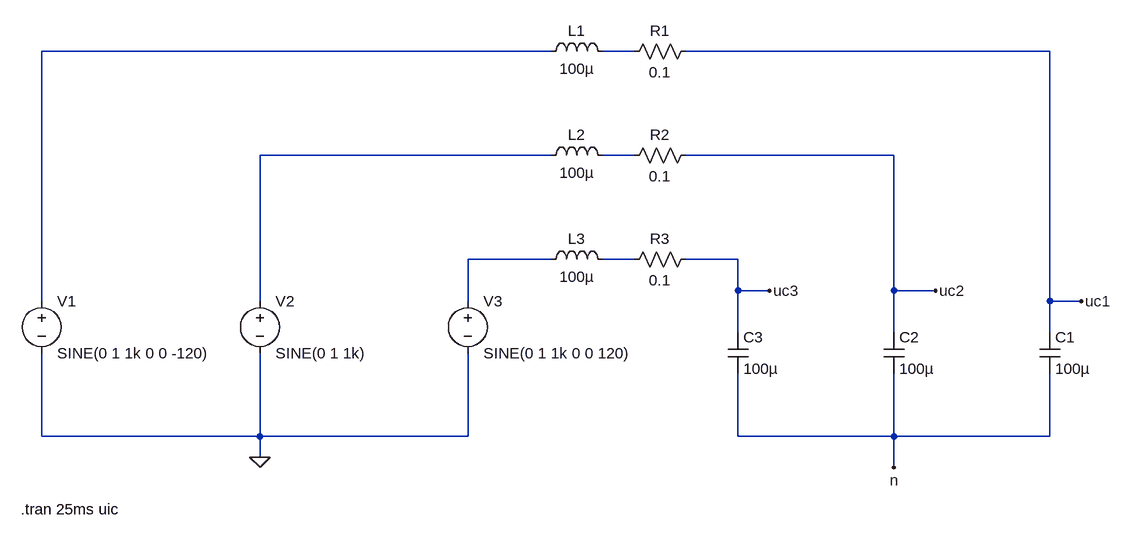
[diagram p0: schematic 3ph_lc.asc]
3ph_lc.asc, the LTspice schematic file:
Version 4
SHEET 1 1684 680
WIRE 736 -224 -48 -224
WIRE 864 -224 816 -224
WIRE 1504 -224 944 -224
WIRE 736 -64 288 -64
WIRE 864 -64 816 -64
WIRE 1264 -64 944 -64
WIRE 736 96 608 96
WIRE 864 96 816 96
WIRE 1024 96 944 96
WIRE 1024 144 1024 96
WIRE 1072 144 1024 144
WIRE 1264 144 1264 -64
WIRE 1328 144 1264 144
WIRE -48 160 -48 -224
WIRE 288 160 288 -64
WIRE 608 160 608 96
WIRE 1504 160 1504 -224
WIRE 1552 160 1504 160
WIRE 1024 208 1024 144
WIRE 1264 208 1264 144
WIRE 1504 208 1504 160
WIRE -48 368 -48 240
WIRE 288 368 288 240
WIRE 288 368 -48 368
WIRE 608 368 608 240
WIRE 608 368 288 368
WIRE 1024 368 1024 272
WIRE 1264 368 1264 272
WIRE 1264 368 1024 368
WIRE 1504 368 1504 272
WIRE 1504 368 1264 368
WIRE 288 400 288 368
WIRE 1264 416 1264 368
FLAG 288 400 0
FLAG 1264 416 n
FLAG 1552 160 uc1
FLAG 1328 144 uc2
FLAG 1072 144 uc3
SYMBOL voltage -48 144 R0
WINDOW 123 0 0 Left 0
WINDOW 39 0 0 Left 0
SYMATTR InstName V1
SYMATTR Value SINE(0 1 1k 0 0 -120)
SYMBOL voltage 288 144 R0
WINDOW 123 0 0 Left 0
WINDOW 39 0 0 Left 0
SYMATTR InstName V2
SYMATTR Value SINE(0 1 1k)
SYMBOL voltage 608 144 R0
WINDOW 123 0 0 Left 0
WINDOW 39 0 0 Left 0
SYMATTR InstName V3
SYMATTR Value SINE(0 1 1k 0 0 120)
SYMBOL ind 720 112 R270
WINDOW 0 32 56 VTop 2
WINDOW 3 5 56 VBottom 2
SYMATTR InstName L3
SYMATTR Value 100µ
SYMBOL ind 720 -48 R270
WINDOW 0 32 56 VTop 2
WINDOW 3 5 56 VBottom 2
SYMATTR InstName L2
SYMATTR Value 100µ
SYMBOL ind 720 -208 R270
WINDOW 0 32 56 VTop 2
WINDOW 3 5 56 VBottom 2
SYMATTR InstName L1
SYMATTR Value 100µ
SYMBOL cap 1008 208 R0
SYMATTR InstName C3
SYMATTR Value 100µ
SYMBOL cap 1248 208 R0
SYMATTR InstName C2
SYMATTR Value 100µ
SYMBOL cap 1488 208 R0
SYMATTR InstName C1
SYMATTR Value 100µ
SYMBOL res 960 -240 R90
WINDOW 0 0 56 VBottom 2
WINDOW 3 32 56 VTop 2
SYMATTR InstName R1
SYMATTR Value 0.1
SYMBOL res 960 -80 R90
WINDOW 0 0 56 VBottom 2
WINDOW 3 32 56 VTop 2
SYMATTR InstName R2
SYMATTR Value 0.1
SYMBOL res 960 80 R90
WINDOW 0 0 56 VBottom 2
WINDOW 3 32 56 VTop 2
SYMATTR InstName R3
SYMATTR Value 0.1
TEXT -80 480 Left 2 !.tran 25ms uic

The netlist it stands for:
* 3ph_lc.asc
V1 N001 0 SINE(0 1 1k 0 0 -120)
V2 N003 0 SINE(0 1 1k)
V3 N005 0 SINE(0 1 1k 0 0 120)
L3 N005 N006 100µ
L2 N003 N004 100µ
L1 N001 N002 100µ
C3 uc3 n 100µ
C2 uc2 n 100µ
C1 uc1 n 100µ
R1 uc1 N002 0.1
R2 uc2 N004 0.1
R3 uc3 N006 0.1
.tran 25ms uic
.backanno
.end